# EAGLE schematic IO_adapter (EAGLE 7.7.0)
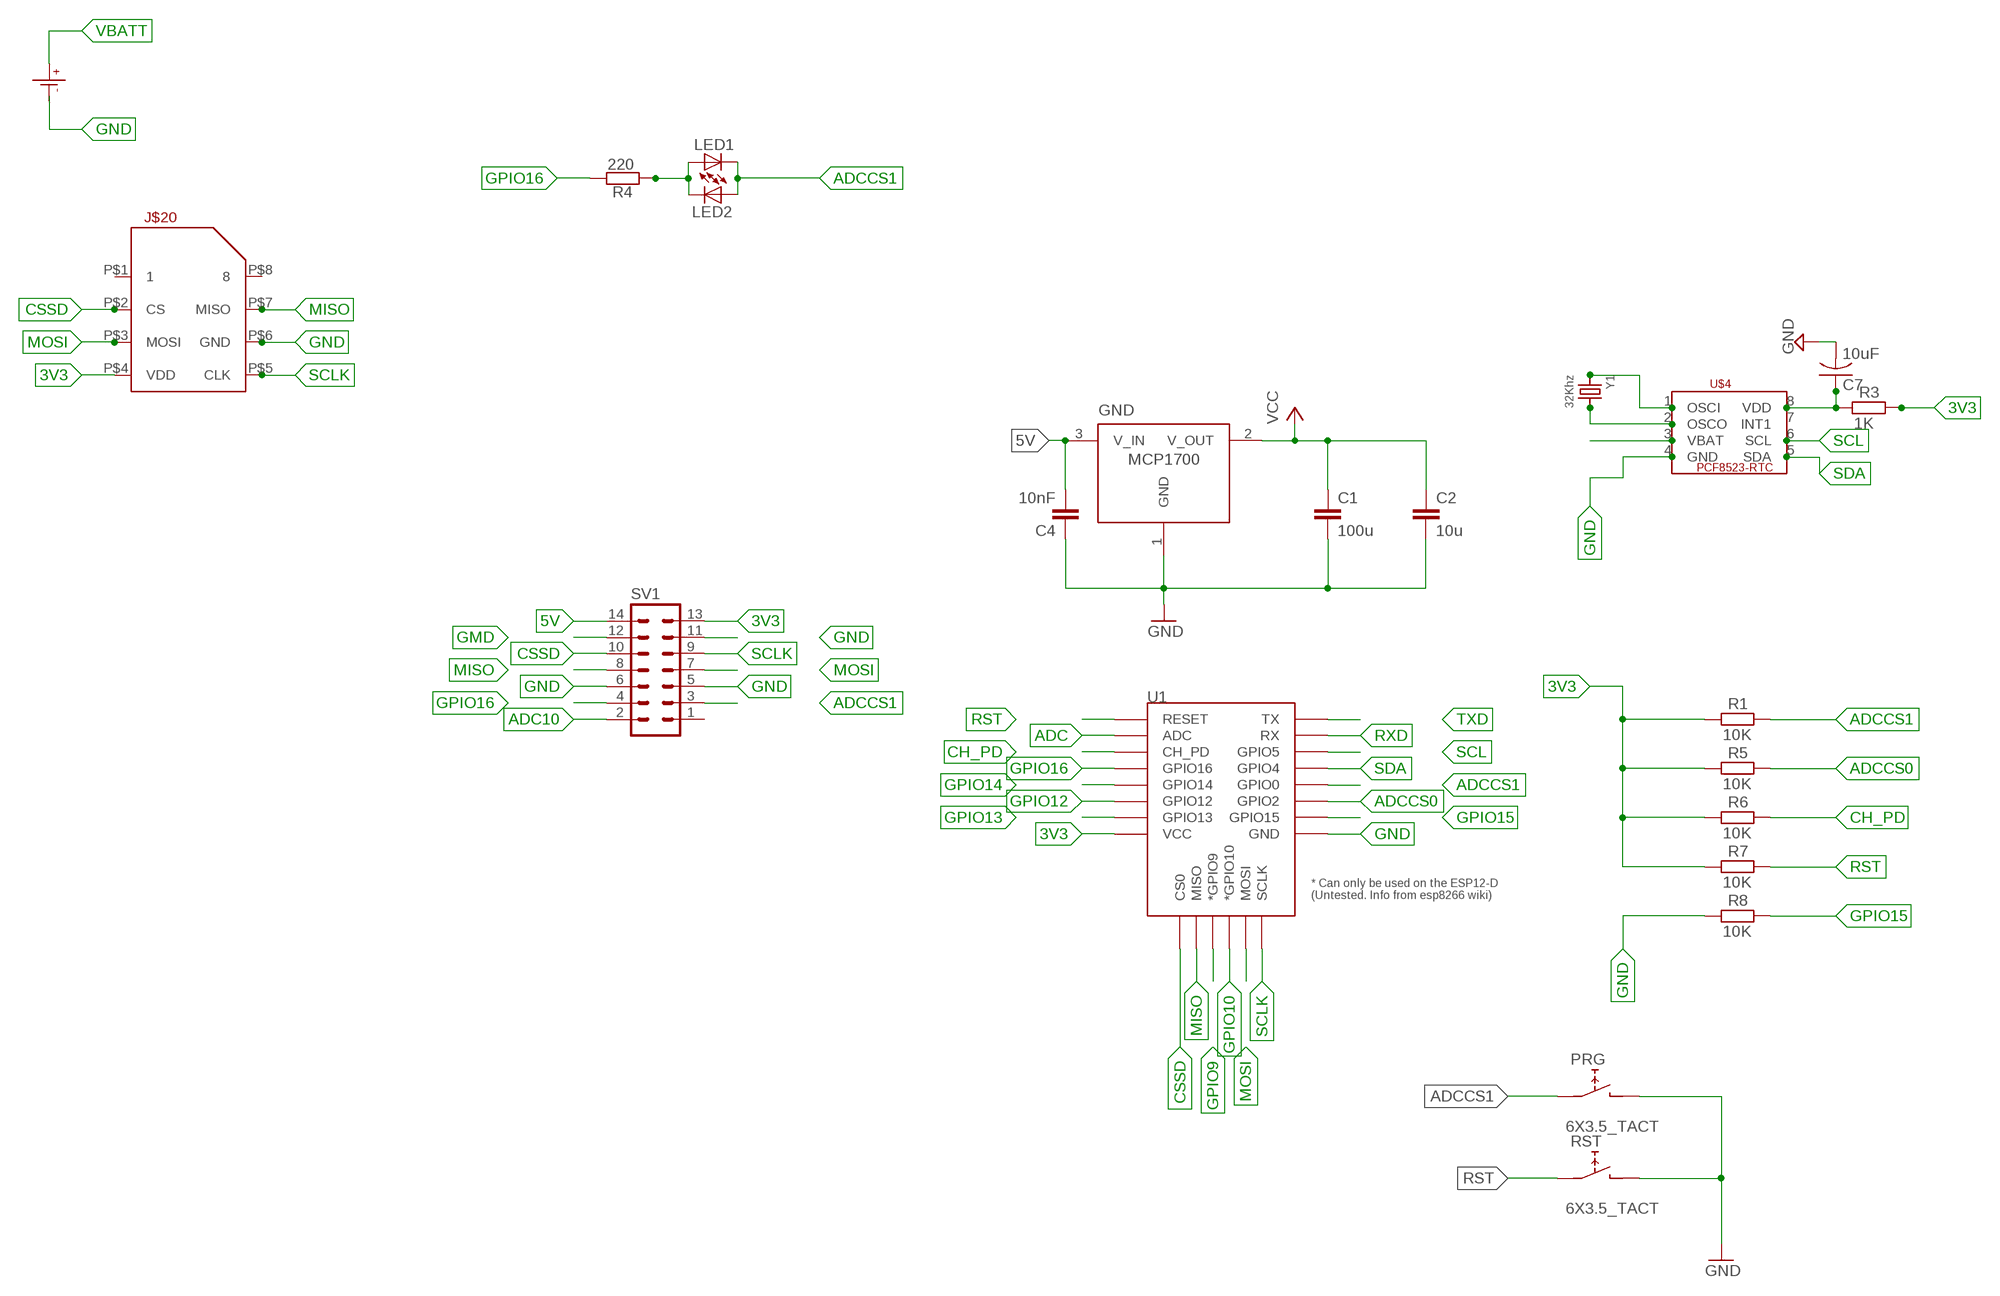
[diagram p0: schematic, sheet 1]

## Parts
C1  100u  C  [C0805]
C2  10u  C  [C0805]
C4  10nF  C  [C0805]
C7  10uF  C-USC0805  [C0805]
GND  MCP1700SOT23  [SOT-23]
J$20  MICROSD_PUSH/PULL  [MICROSD]
LED1  LEDCHIPLED_0805  [CHIPLED_0805]
LED2  LEDCHIPLED_0805  [CHIPLED_0805]
PRG  6X3.5_TACT  [TACT_6X3.5]
R1  10K  R-EU_R0805  [R0805]
R3  1K  R-EU_R0805  [R0805]
R4  220  R-EU_R0805  [R0805]
R5  10K  R-EU_R0805  [R0805]
R6  10K  R-EU_R0805  [R0805]
R7  10K  R-EU_R0805  [R0805]
R8  10K  R-EU_R0805  [R0805]
RST  6X3.5_TACT  [TACT_6X3.5]
SV1  MA07-2  [MA07-2]
U1  ESP12ESMD  [ESP12E-SMD]
U$1  CR1220SMD  [CR1220SMD]
U$4  PCF8523_RTC  [SOIC_8]
Y1  32Khz  CRYSTAL8X3.8SMT  [CRYSTAL_8X3.8]

## Nets
3V3: C1.1 C2.1 GND.2(V_OUT) J$20.P$4(VDD) R1.1 R3.2 R5.1 R6.1 R7.1 SV1.13 U1.VCC ; supply symbol labelled VCC
5V: C4.2 GND.3(V_IN) SV1.14
ADC: U1.ADC
ADC10: SV1.2
ADCCS0: R5.2 U1.GPIO2
ADCCS1: LED1.C LED2.A PRG.P$1 R1.2 SV1.3 U1.GPIO0
CH_PD: R6.2 U1.CH_PD
CSSD: J$20.P$2(CS) SV1.10 U1.CS0
GMD: SV1.12
GND: C1.2 C2.2 C4.1 C7.2 GND.1(GND) J$20.P$6(GND) PRG.P$2 R8.1 RST.P$2 SV1.5 SV1.6 SV1.11 U1.GND U$4.4(GND)
GPIO9: U1.GPIO9(*GPIO9)
GPIO10: U1.GPIO10(*GPIO10)
GPIO12: U1.GPIO12
GPIO13: U1.GPIO13
GPIO14: U1.GPIO14
GPIO15: R8.2 U1.GPIO15
GPIO16: R4.2 SV1.4 U1.GPIO16
MISO: J$20.P$7(MISO) SV1.8 U1.MISO
MOSI: J$20.P$3(MOSI) SV1.7 U1.MOSI
N$1: C7.1 R3.1 U$4.8(VDD)
N$8: LED1.A LED2.C R4.1
N$44: U$4.2(OSCO) Y1.P$4
N$45: U$4.1(OSCI) Y1.P$1
RST: R7.2 RST.P$1 U1.RESET
RXD: U1.RXD0(RX)
SCL: U1.GPIO5 U$4.6(SCL)
SCLK: J$20.P$5(CLK) SV1.9 U1.SCLK
SDA: U1.GPIO4 U$4.5(SDA)
TXD: U1.TXD0(TX)
VBATT: U$1.P+(P$+) U$4.3(VBAT)
Unconnected: J$20.P$1 J$20.P$8 SV1.1 U$1.P-(P$-) U$4.7(INT1)

## Library data of the parts
C1 C2 C4 = eagle-ltspice:C: CAPACITOR, European symbol; SPICEMODEL: NONE; SPICEPREFIX: C
C7 = adafruit:C-US: CAPACITOR, American symbol
GND = MCP1700:MCP1700SOT23
J$20 = IotaWatt_parts:MICROSD_PUSH/PULL: McroSD Amphenol push/pull
LED1 LED2 = adafruit:LED: LED OSRAM: - CHIPLED LG R971, LG N971, LY N971, LG Q971, LY Q971, LO R971, LY R971 LH N974, LH R974 LS Q976, LO Q976, LY Q976 LO Q996 - Hyper CHIPLED LW Q18S LB Q993, LB Q99A, LB R99A - SideLED LS A670, LO A670, LY A670, LG A670, LP A670 LB A673, LV A673, LT A673, LW A673 LH A674 LY A675 LS A676, LA A676, LO A676, LY A676, LW A676 LS A679, LY A679, LG A679 - Hyper Micro SIDELED® LS Y876, LA Y876, LO Y876, LY Y876 LT Y87S - SmartLED LW L88C, LW L88S LB L89C, LB L89S, LG L890 LS L89K, LO L89K, LY L89K LS L896, LA L896, LO L896, LY L896 - TOPLED LS T670, LO T670, LY T670, LG T670, LP T670 LSG T670, LSP T670, LSY T670, LOP T670, LYG T670 LG T671, LOG T671, LSG T671 LB T673, LV T673, LT T673, LW T673 LH T674 LS T676, LA T676, LO T676, LY T676, LB T676, LH T676, LSB T676, LW T676 LB T67C, LV T67C, LT T67C, LS T67K, LO T67K, LY T67K, LW E67C LS E67B, LA E67B, LO E67B, LY E67B, LB E67C, LV E67C, LT E67C LW T67C LS T679, LY T679, LG T679 LS T770, LO T770, LY T770, LG T770, LP T770 LB T773, LV T773, LT T773, LW T773 LH T774 LS E675, LA E675, LY E675, LS T675 LS T776, LA T776, LO T776, LY T776, LB T776 LHGB T686 LT T68C, LB T68C - Hyper Mini TOPLED® LB M676 - Mini TOPLED Santana® LG M470 LS M47K, LO M47K, LY M47K Source: http://www.osram.convergy.de/
PRG RST = tactile_switch:6X3.5_TACT
R1 R3-R8 = resistor:R-EU_: RESISTOR, European symbol
SV1 = con-lstb:MA07-2: PIN HEADER; OC_FARNELL: unknown; OC_NEWARK: unknown
U1 = esp8266modules:ESP12E: ESP12E Module
U$1 = IotaWatt4.8:CR1220SMD: CR1220 Battery SMD
U$4 = IotaWatt_parts:PCF8523_RTC: PCF8523-RTC SOIC-8
Y1 = microbuilder:CRYSTAL: Crystals HC49UP - Surface Mount Crystal 4.0MHz 18pF +/-30ppm Surface Mount Crystal [Digikey: 535-9857-1-ND] 12.0 MHz Surface Mount Crystal [Digikey: 535-9869-6-ND] 25.0 MHz Surface Mount Crystal [Digikey: 535-9078-1-ND] 2.5 x 2.0mm - MEMs SMT Crystal 16.0 MHz 10pF 20ppm 2.5 x 2.0mm Crystal [Digikey -40-85°C: 535-10923-1-ND] 3.2 x 2.5mm - MEMs SMT Crystal 12.0 MHz 8pF 15ppm 3.2 x 2.5mm Crystal [Digikey: -10-70°C: 644-1047-1-ND -40-125°C: 644-1128-1-ND] 16.0 MHz 8pF 15ppm 3.2 x 2.5mm Crystal [Digikey: -10-70°C: 644-1049-1-ND -40-125°C: 644-1129-2-ND] 16.0 MHz 10pF 10ppm 3.2 x 2.5mm Crystal [Digikey: 644-1100-1-ND] 27.12 MHz 18pF 30ppm 3.2 x 2.5mm Crystal [Digikey: 887-1424-1-ND] 27.12MHz 10pF 10ppm 3.2 x 2.5mm Crystal [Digikey: 887-1329-1-ND] 4.9 x 1.8mm - MEMs SMT Crystal 32.768 KHz 12.5pF 20ppm 4.9 x 1.8mm Crystal [Digikey: SE2415CT-ND] 8.0 x 3.8mm - Surface Mount Crystal 32.768kHz 12.5pF 20ppm -40°C-85°C [Digikey: 535-9166-2-ND] Cylinder 32.768KHz Cylinder Crystal (2x6mm body) [Ex. Digikey: 300-8341-2-ND]